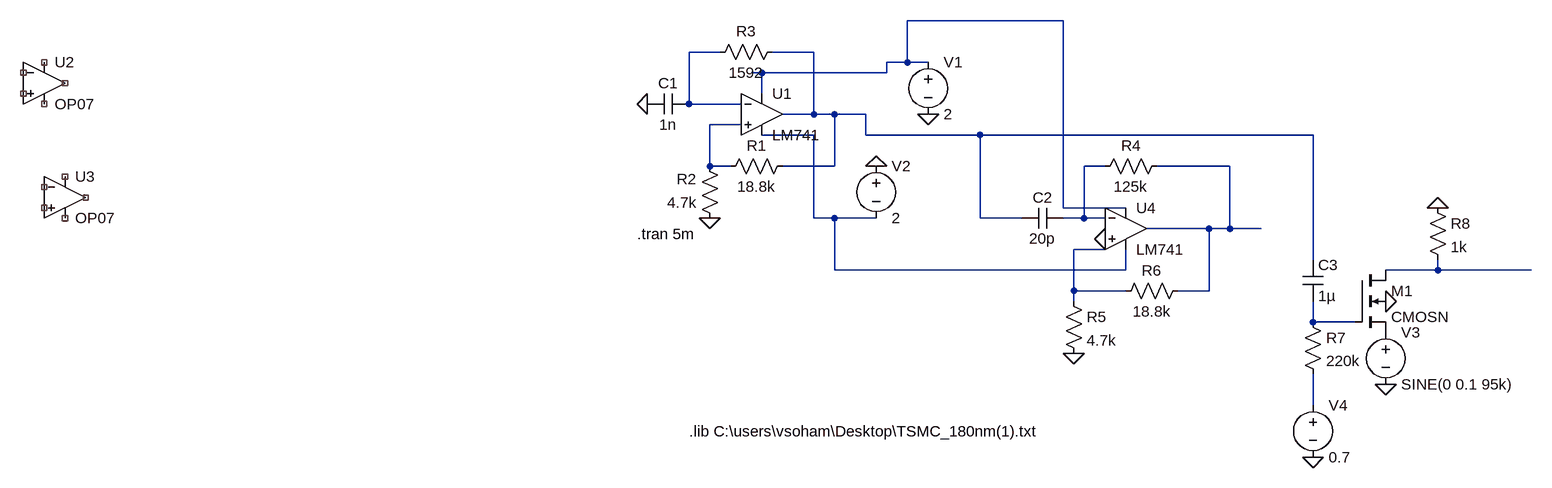
[diagram p0: schematic Quadrature Osc_Self.asc]
Quadrature Osc_Self.asc, the LTspice schematic file:
Version 4
SHEET 1 1716 692
WIRE 672 0 432 0
WIRE 144 48 96 48
WIRE 288 48 224 48
WIRE 432 64 432 0
WIRE 432 64 400 64
WIRE 464 64 432 64
WIRE 208 80 192 80
WIRE 400 80 400 64
WIRE 400 80 208 80
WIRE 208 112 208 80
WIRE 96 128 96 48
WIRE 176 128 96 128
WIRE 288 144 288 48
WIRE 288 144 240 144
WIRE 320 144 288 144
WIRE 368 144 320 144
WIRE 176 160 128 160
WIRE 288 176 208 176
WIRE 368 176 368 144
WIRE 544 176 368 176
WIRE 1056 176 544 176
WIRE 128 224 128 160
WIRE 160 224 128 224
WIRE 320 224 320 144
WIRE 320 224 240 224
WIRE 736 224 704 224
WIRE 928 224 816 224
WIRE 672 288 672 0
WIRE 768 288 672 288
WIRE 288 304 288 176
WIRE 320 304 288 304
WIRE 384 304 320 304
WIRE 544 304 544 176
WIRE 608 304 544 304
WIRE 704 304 704 224
WIRE 704 304 672 304
WIRE 736 304 704 304
WIRE 896 320 800 320
WIRE 928 320 928 224
WIRE 928 320 896 320
WIRE 976 320 928 320
WIRE 736 352 688 352
WIRE 1056 368 1056 176
WIRE 320 384 320 304
WIRE 768 384 768 352
WIRE 768 384 320 384
WIRE 1248 384 1248 368
WIRE 1248 384 1168 384
WIRE 1392 384 1248 384
WIRE 688 416 688 352
WIRE 768 416 688 416
WIRE 896 416 896 320
WIRE 896 416 848 416
WIRE 688 432 688 416
WIRE 1056 464 1056 432
WIRE 1120 464 1056 464
WIRE 1056 592 1056 544
FLAG 32 128 0
FLAG 128 304 0
FLAG 464 144 0
FLAG 384 224 0
FLAG 688 512 0
FLAG 736 336 0
FLAG 1168 432 0
FLAG 1168 560 0
FLAG 1056 672 0
FLAG 1248 288 0
SYMBOL res 256 208 R90
WINDOW 0 0 56 VBottom 2
WINDOW 3 32 56 VTop 2
SYMATTR InstName R1
SYMATTR Value 18.8k
SYMBOL res 144 320 R180
WINDOW 0 36 76 Left 2
WINDOW 3 36 40 Left 2
SYMATTR InstName R2
SYMATTR Value 4.7k
SYMBOL cap 96 112 R90
WINDOW 0 0 32 VBottom 2
WINDOW 3 32 32 VTop 2
SYMATTR InstName C1
SYMATTR Value 1n
SYMBOL res 240 32 R90
WINDOW 0 0 56 VBottom 2
WINDOW 3 32 56 VTop 2
SYMATTR InstName R3
SYMATTR Value 1592
SYMBOL voltage 464 48 R0
WINDOW 123 0 0 Left 0
WINDOW 39 0 0 Left 0
SYMATTR InstName V1
SYMATTR Value 2
SYMBOL voltage 384 208 R0
WINDOW 123 0 0 Left 0
WINDOW 39 0 0 Left 0
SYMATTR InstName V2
SYMATTR Value 2
SYMBOL OpAmps\\OP07 -896 32 R0
SYMATTR InstName U2
SYMBOL cap 672 288 R90
WINDOW 0 0 32 VBottom 2
WINDOW 3 32 32 VTop 2
SYMATTR InstName C2
SYMATTR Value 20p
SYMBOL OpAmps\\OP07 -864 208 R0
SYMATTR InstName U3
SYMBOL res 832 208 R90
WINDOW 0 0 56 VBottom 2
WINDOW 3 32 56 VTop 2
SYMATTR InstName R4
SYMATTR Value 125k
SYMBOL res 672 416 R0
SYMATTR InstName R5
SYMATTR Value 4.7k
SYMBOL res 864 400 R90
WINDOW 0 0 56 VBottom 2
WINDOW 3 32 56 VTop 2
SYMATTR InstName R6
SYMATTR Value 18.8k
SYMBOL voltage 1168 464 R0
WINDOW 123 0 0 Left 0
WINDOW 39 0 0 Left 0
SYMATTR InstName V3
SYMATTR Value SINE(0 0.1 95k)
SYMBOL nmos4 1120 384 R0
SYMATTR InstName M1
SYMATTR Value CMOSN
SYMATTR Value2 l=0.18u w=1.8u ad=0.81p as=0.81p pd=4.5u ps=4.5u
SYMBOL cap 1040 368 R0
SYMATTR InstName C3
SYMATTR Value 1µ
SYMBOL voltage 1056 576 R0
WINDOW 123 0 0 Left 0
WINDOW 39 0 0 Left 0
SYMATTR InstName V4
SYMATTR Value 0.7
SYMBOL res 1040 448 R0
SYMATTR InstName R7
SYMATTR Value 220k
SYMBOL res 1232 272 R0
SYMATTR InstName R8
SYMATTR Value 1k
SYMBOL LM741 208 80 R0
SYMATTR InstName U1
SYMBOL LM741 768 256 R0
SYMATTR InstName U4
TEXT 16 328 Left 2 !.tran 5m
TEXT 96 632 Left 2 !.lib C:\\users\\vsoham\\Desktop\\TSMC_180nm(1).txt

The netlist it stands for:
* Quadrature Osc_Self.asc
R1 N003 N004 18.8k
R2 0 N004 4.7k
C1 N002 0 1n
R3 N003 N002 1592
V1 N001 0 2
V2 0 N005 2
XU2 NC_01 NC_02 NC_03 NC_04 NC_05 LT1001  ; OP07, pins In+ In- V+ V- OUT
C2 N006 N003 20p
XU3 NC_06 NC_07 NC_08 NC_09 NC_10 LT1001  ; OP07, pins In+ In- V+ V- OUT
R4 N007 N006 125k
R5 N008 0 4.7k
R6 N007 N008 18.8k
V3 P001 0 SINE(0 0.1 95k)
M1 N009 N010 P001 0 CMOSN l=0.18u w=1.8u ad=0.81p as=0.81p pd=4.5u ps=4.5u
C3 N003 N010 1µ
V4 N011 0 0.7
R7 N010 N011 220k
R8 0 N009 1k
XU1 N004 N002 N001 N005 N003 LM741  ; pins In+ In- V+ V- OUT
XU4 0 N006 N001 N005 N007 LM741  ; pins In+ In- V+ V- OUT
.model NMOS NMOS
.model PMOS PMOS
.lib standard.mos
.tran 5m
.lib C:\users\vsoham\Desktop\TSMC_180nm(1).txt
.lib LTC.lib
.lib LM741.lib
.backanno
.end